# EasyEDA Pro project Complete_project.epro, board PCB1
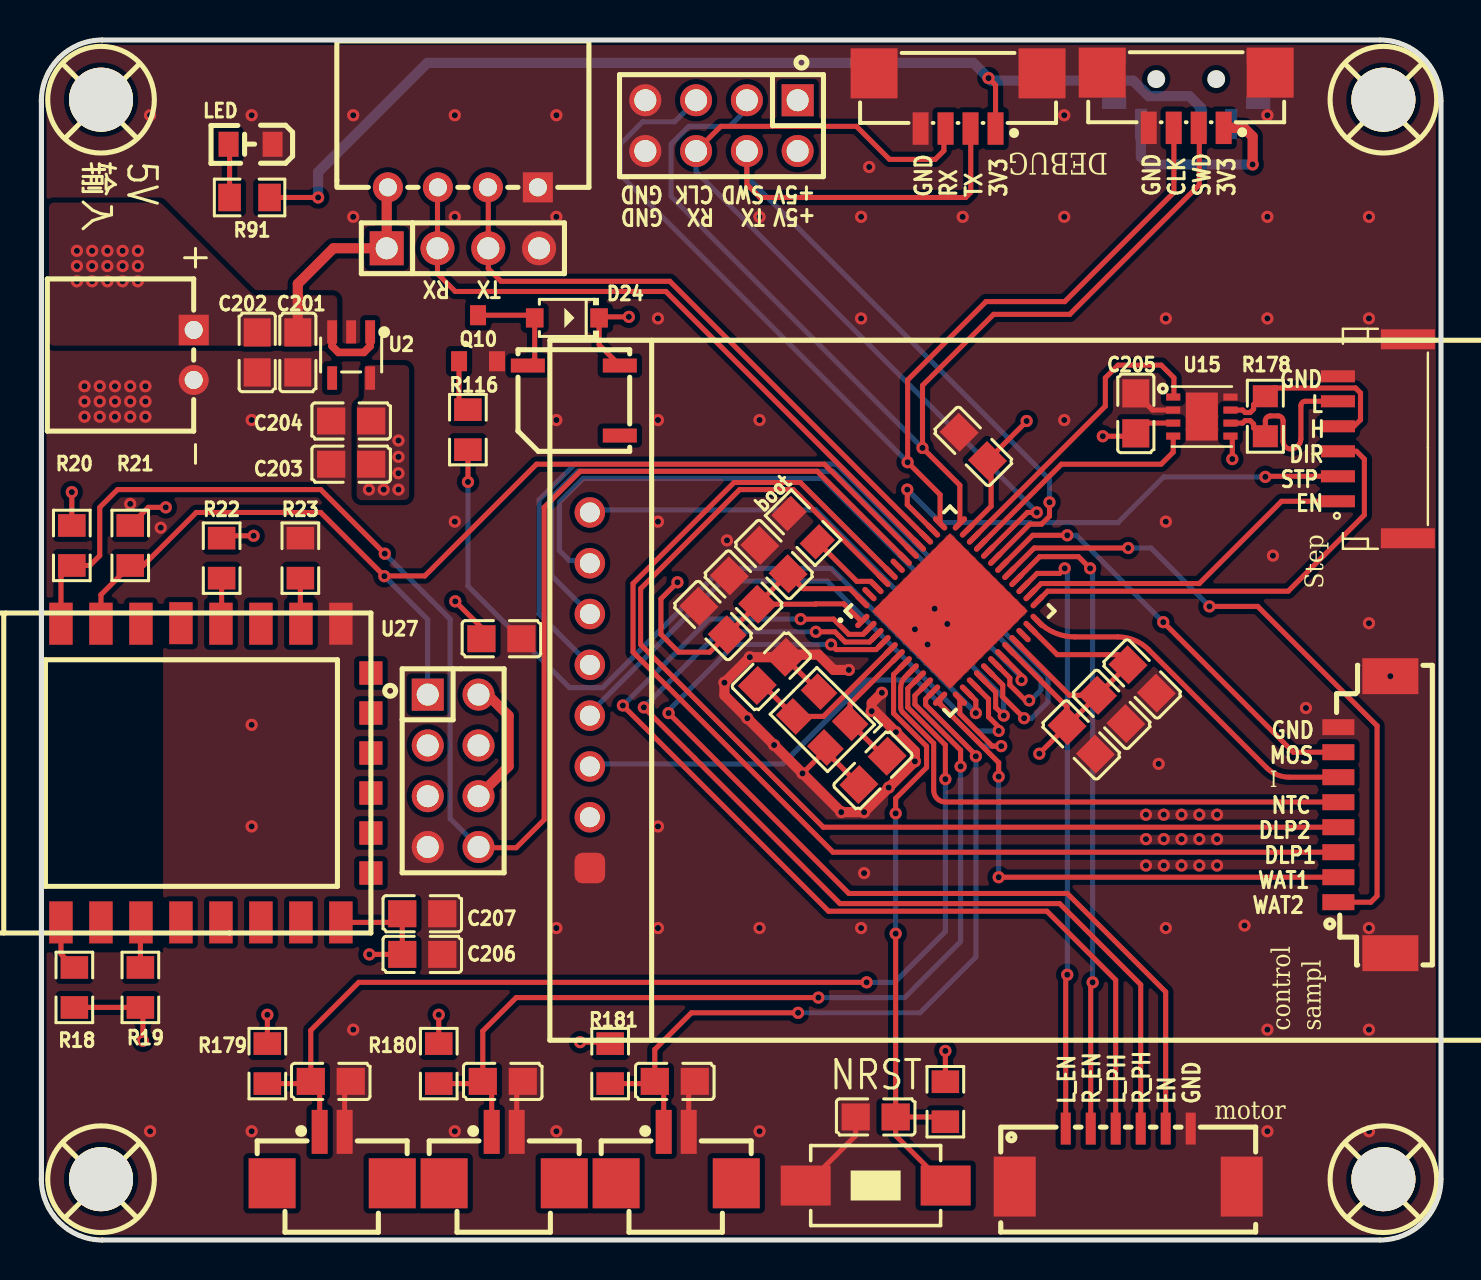
[diagram p12: board, top side]
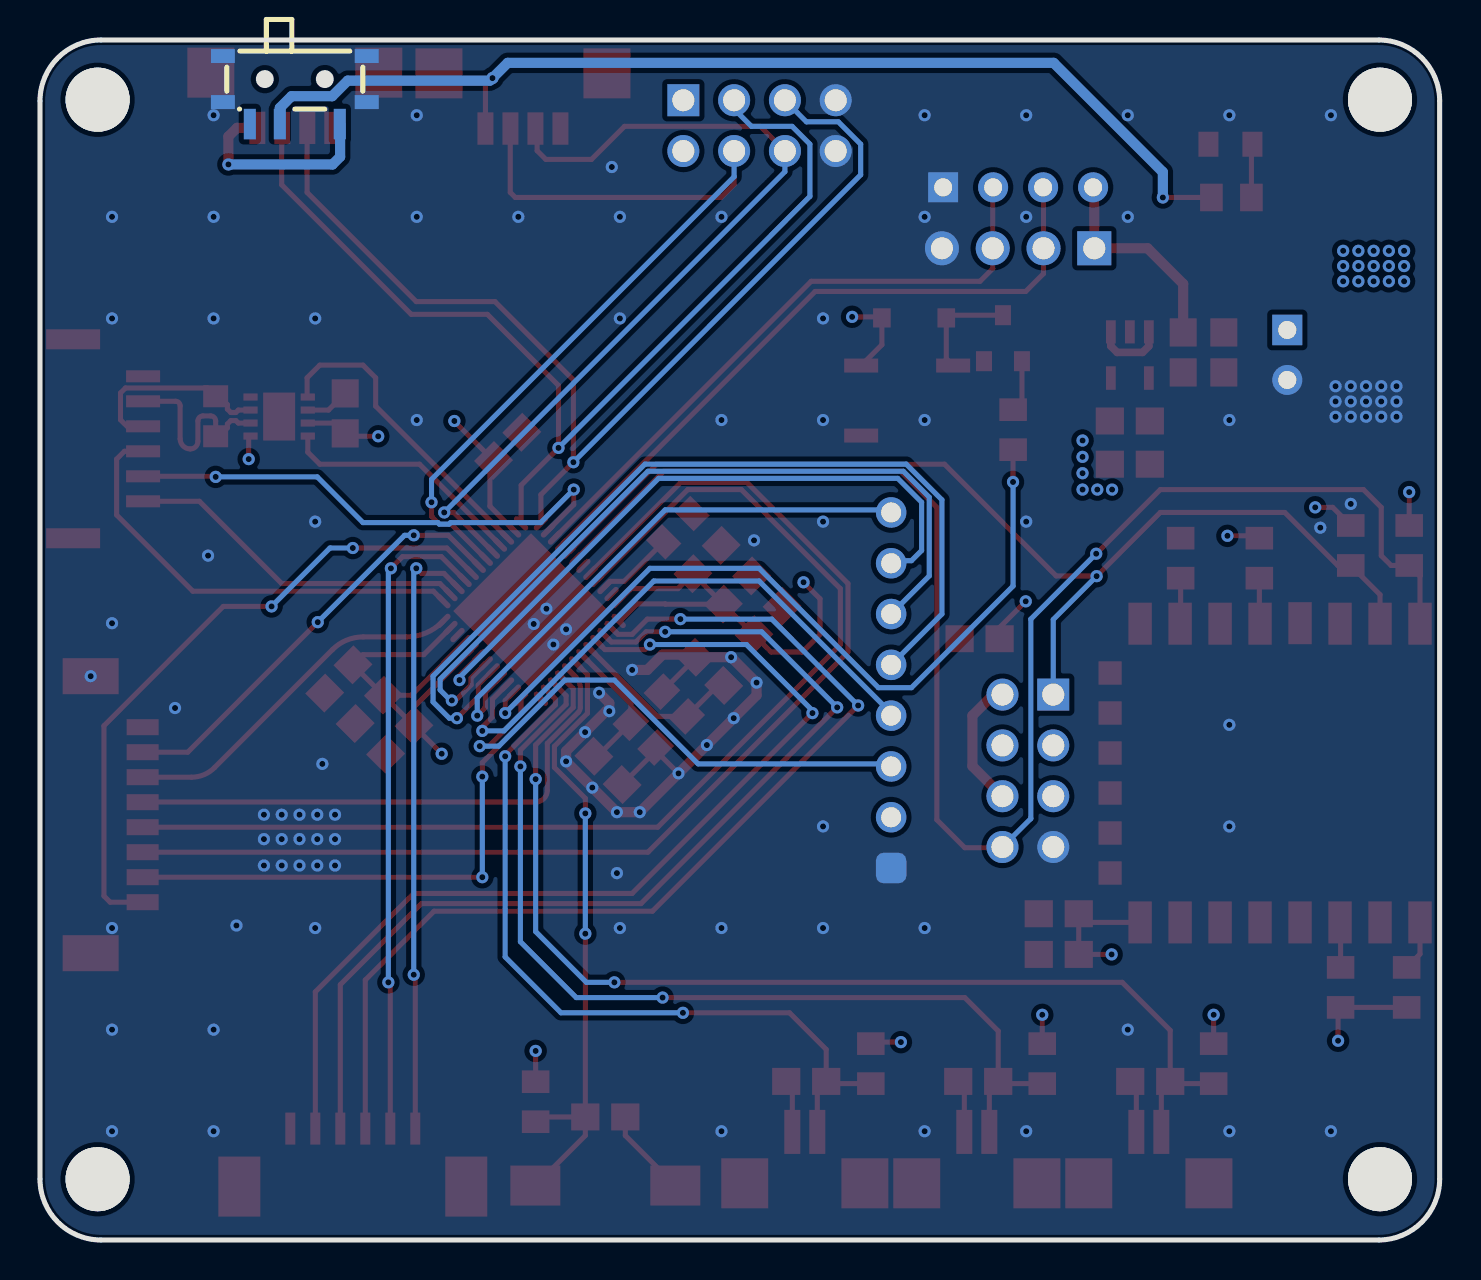
[diagram p13: board, bottom side, seen from below]

Outline 70 x 60 mm; copper layers: Top Layer, POWER, GND, Bottom Layer. Coordinates in mm from the lower left corner of the outline.
Outline path: 0,56.95 0,3.05 arc(0.89,0.89) 3.05,0 66.95,0 arc(69.11,0.89) 70,3.05 70,56.95 arc(69.11,59.11) 66.95,60 3.05,60 arc(0.89,59.11) 0,56.95
Stack: Top Layer 0.035mm 外层铜厚1oz / Dielectric1 0.2104mm 7628 RC49% 8.6mil / POWER 0.035mm / Dielectric2 1.065mm 1.1mm H/HOZ Copper / GND 0.035mm / Dielectric3 0.2104mm 7628 RC49% 8.6mil / Bottom Layer 0.035mm 外层铜厚1oz

## Design rules (mm)
net CAN_L: CAN
net CAN_H: CAN
template: 自定义配置
spacing copperThickness1oz (default): track to track 0.102, other pairs 0.152 to 0.3
spacing copperThickness2oz: track to track 0.203, other pairs 0.152 to 0.3
track width copperThickness1oz (default): min 0.127, default 0.254, max 2.54
track width copperThickness2oz: min 0.203, default 0.254, max 2.54
differential pair differentialPair (default): width min 0.127, default 0.254, max 2.54; gap min 0.152, default 0.152
via viaSize (default): diameter min 0.5, default 0.61, max 10; hole min 0.3, default 0.305, max 6.3

## Placement (name value [footprint] x y rotation side)
boot  -  [R0805]  38.1 35.62 315 top
BUZZER2  4kHz  [BUZ-SMD_L5.0-W5.5-P4.60]  26.63 41.97 180 top
C10  100nF  [C0805]  41.73 6.15 180 top
C22  100nF  [C0805]  35.12 32.5 315 top
C23  100nF  [C0805]  33.59 30.97 315 top
C36  100nF  [C0805]  36.64 34.02 315 top
C37  100nF  [C0805]  46.61 39.68 315 top
C38  100nF  [C0805]  53.53 26.53 135 top
C39  100nF  [C0805]  55.05 28.05 135 top
C88  100nF  [C0805]  52.01 25 135 top
C89  100nF  [C0805]  23.01 30.06 180 top
C90  100nF  [C0805]  14.47 7.93 0 top
C142  22pF  [C0805]  36.51 28.43 225 top
C143  22pF  [C0805]  41.59 23.48 45 top
C145  100nF  [C0805]  23.08 7.93 0 top
C146  100nF  [C0805]  31.68 7.93 0 top
C201  100nF  [C0805]  12.83 44.38 90 top
C202  100nF  [C0805]  10.79 44.38 90 top
C203  100nF  [C0805]  15.49 38.79 0 top
C204  100nF  [C0805]  15.49 40.95 0 top
C205  100nF  [C0805]  54.74 41.33 270 top
C206  100nF  [C0805]  19.05 14.28 180 top
C207  1uF  [C0805]  19.05 16.31 180 top
CN12  HC-1.25-4PLT  [CONN-SMD_4P-P1.25_HCTL_HC-1.25-4PLT]  57.26 56.99 180 top
CN16  ZX-XH2.54-2PWZ  [CONN-TH_2P-P2.50_ZX-XH2.54-2PWZ]  7.62 44.25 270 top
CN17  HC-1.25-4PLT  [CONN-SMD_4P-P1.25_HCTL_HC-1.25-4PLT]  45.85 56.95 180 top
CN18  HC-1.25-2PWT  [CONN-SMD_2P-P1.25-HC-1.25-2PWT]  14.54 4.12 0 top
CN19  HC-1.25-2PWT  [CONN-SMD_2P-P1.25-HC-1.25-2PWT]  23.15 4.12 0 top
CN20  HC-1.25-2PWT  [CONN-SMD_2P-P1.25-HC-1.25-2PWT]  31.75 4.12 0 top
control
sampl  -  [CONN-SMD_8P-P1.25-L4.4-W14.8]  66.17 21.27 90 top
D24  1N4148W  [SOD-123_L2.7-W1.6-LS3.7-FD]  26.28 46.11 0 top
H4  -  [HDR-TH_8P-P2.54-V-F-R2-C4-S2.54-1]  34.02 55.72 180 top
H9  -  [HDR-TH_8P-P2.54-V-F-R2-C4-S2.54-1]  20.59 23.46 270 top
H12  -  [HDR-TH_4P-P2.54-V-M]  21.08 49.59 0 top
LED  -  [LED_0805]  10.41 54.79 180 top
motor  -  [CONN-SMD_1.25-6PWT]  54.36 4.12 180 top
Q10  -  [S8050_SOT-23]  21.71 45.09 270 top
R6  10K  [R0805]  45.21 6.91 90 top
R18  1K  [R0805]  1.65 12.63 90 top
R19  1K  [R0805]  4.95 12.63 90 top
R20  5.1K  [R0805]  1.52 34.73 90 top
R21  5.1K  [R0805]  4.44 34.73 90 top
R22  1K  [R0805]  9.02 34.09 90 top
R23  1K  [R0805]  12.95 34.09 90 top
R91  10K  [R0805]  10.41 52.13 0 top
R116  2K  [R0805]  21.33 40.52 90 top
R178  120Ω  [R0805_S]  61.21 42.19 270 top
R179  10K  [R0805]  11.3 8.82 90 top
R180  10K  [R0805]  19.88 8.82 90 top
R181  10K  [R0805]  28.45 8.82 90 top
RESET1  -  [SW_PB2_A1]  41.78 2.72 90 top
SCREW1  -  [M3螺丝]  3.05 2.98 0 top
SCREW2  -  [M3螺丝]  3.05 56.95 0 top
SCREW3  -  [M3螺丝]  67.18 56.95 0 top
SCREW4  -  [M3螺丝]  67.18 2.98 0 top
Step  -  [CONN-TH_SM06B-GHS-TB-LF-SN]  66.59 40.06 90 top
SW5  MSK12C02  [SW-TH_MSK12C02]  57.26 57.5 0 bottom
U2  RT9013-33GB  [SOT-23-5_L3.0-W1.7-P0.95-LS2.8-BL]  15.49 44.25 180 top
U15  TJA1051TK/3/1J  [HVSON-8_L3.0-W3.0-P0.65-BL-EP]  58.04 41.17 270 top
U26  STM32G431CBU6  [UFQFPN-48_L7.0-W7.0-P0.50-BL-EP]  45.44 31.45 315 top
U27  -  [ESP12F]  6.98 23.3 90 top
U28  -  [1.8__TFT LCD]  27.43 18.6 90 top
U51  ZX-XH2.54-4PWZ-Y  [CONN-TH_4P-P2.50_ZX-XH2.54-4PWZ-Y]  21.08 52.63 180 top
X1  25MHz  [OSC-SMD_4P-L3.2-W2.5-BL]  39.05 26.02 135 top

## Footprints (pads in the part's own frame, mm; a bottom-side part is the same pattern mirrored in y, then rotated)
1.8__TFT LCD
  custom 0x0 hole 1: 1(0,0)
  round 1.524 hole 1: 2(2.54,0) 3(5.08,0) 4(7.62,0) 5(10.16,0) 6(12.7,0) 7(15.24,0) 8(17.78,0)
BUZ-SMD_L5.0-W5.5-P4.60
  rect 1.7x0.7 smd: 1(-2.3,-1.75) 2(2.3,-1.75) 3(-2.3,1.75)
C0805
  rect 1.41x1.35 smd: 1(-1,0) 2(1,0)
CONN-SMD_1.25-6PWT
  rect 0.5x1.6 smd: 1(3.125,-1.45) 2(1.875,-1.45) 3(0.625,-1.45) 4(-0.625,-1.45) 5(-1.875,-1.45) 6(-3.125,-1.45)
  rect 2.1x3 smd: 7(-5.675,1.45) 8(5.675,1.45)
CONN-SMD_2P-P1.25-HC-1.25-2PWT
  rect 0.8x2.2 smd: 1(-0.625,1.285) 2(0.625,1.285)
  rect 2.35x2.5 smd: 3(-3.005,-1.285) 4(3.005,-1.285)
CONN-SMD_4P-P1.25_HCTL_HC-1.25-4PLT
  rect 0.8x1.62 smd: 1(-1.875,1.38) 2(-0.625,1.38) 3(0.625,1.38) 4(1.875,1.38)
  rect 2.35x2.5 smd: 5(-4.2,-1.38) 6(4.2,-1.38)
CONN-SMD_8P-P1.25-L4.4-W14.8
  rect 1.8x2.8 smd: 0(-6.925,-1.3) 0(6.925,-1.3)
  rect 0.8x1.6 smd: 1(-4.375,1.3) 2(-3.125,1.3) 3(-1.875,1.3) 4(-0.625,1.3) 5(0.625,1.3) 6(1.875,1.3) 7(3.125,1.3) 8(4.375,1.3)
CONN-TH_2P-P2.50_ZX-XH2.54-2PWZ
  rect 1.524x1.5 hole 0.9: 1(-1.25,0)
  round 1.5 hole 0.9: 2(1.25,0)
CONN-TH_4P-P2.50_ZX-XH2.54-4PWZ-Y
  rect 1.5x1.5 hole 0.9: 1(-3.75,0)
  round 1.5 hole 0.9: 2(-1.25,0) 3(1.25,0) 4(3.75,0)
CONN-TH_SM06B-GHS-TB-LF-SN
  rect 0.6x1.7 smd: 1(-3.126,1.75) 2(-1.875,1.75) 3(-0.625,1.75) 4(0.625,1.75) 5(1.875,1.75) 6(3.124,1.75)
  rect 1x2.7 smd: 7(-4.974,-1.749) 8(4.974,-1.75)
ESP12F
  rect 2.1x1.17 smd: 1(-7.417,6.003) 2(-7.417,4.003) 3(-7.417,2.003) 4(-7.417,0.004) 5(-7.417,-1.996) 6(-7.417,-3.997) 7(-7.417,-5.997) 8(-7.417,-7.997) 15(7.519,-7.997) 16(7.519,-5.997) 17(7.519,-3.997) 18(7.519,-1.996) 19(7.544,0.004) 20(7.519,2.003) 21(7.519,4.003) 22(7.519,6.003)
  custom 0x0 smd: 9(-4.948,-9.496) 10(-2.948,-9.496) 11(-0.948,-9.496) 12(1.052,-9.496) 13(3.052,-9.496) 14(5.052,-9.496)
HDR-TH_4P-P2.54-V-M
  rect 1.7x1.7 hole 1.1: 1(-3.81,0)
  round 1.7 hole 1.1: 2(-1.27,0) 3(1.27,0) 4(3.81,0)
HDR-TH_8P-P2.54-V-F-R2-C4-S2.54-1
  rect 1.6x1.6 hole 1.1: 1(-3.81,-1.27)
  round 1.6 hole 1.1: 2(-3.81,1.27) 3(-1.27,-1.27) 4(-1.27,1.27) 5(1.27,-1.27) 6(1.27,1.27) 7(3.81,-1.27) 8(3.81,1.27)
HVSON-8_L3.0-W3.0-P0.65-BL-EP
  rect 0.355x0.711 smd: 1(-0.976,-1.433) 2(-0.325,-1.433) 3(0.325,-1.433) 4(0.976,-1.433) 5(0.976,1.433) 6(0.325,1.433) 7(-0.325,1.433) 8(-0.976,1.433)
  rect 2.401x1.6 smd: 9(0,0)
LED_0805
  rect 1x1.25 smd: 1(-1.15,0.005) 2(1.05,0.005)
M3螺丝
  round 3.2 hole 3.2: 1(-0.064,0.064)
OSC-SMD_4P-L3.2-W2.5-BL
  rect 1.4x1.2 smd: 1(-1.1,-0.875) 2(1.1,-0.875) 3(1.1,0.875) 4(-1.1,0.875)
R0805
  rect 1.133x1.377 smd: 1(-1,0) 2(1,0)
R0805_S
  rect 1.1x1.25 smd: 1(0,0) 2(2,0)
S8050_SOT-23
  rect 1x0.8 smd: 1(1.15,-0.823) 2(1.15,1.077) 3(-1.15,0.127)
SOD-123_L2.7-W1.6-LS3.7-FD
  rect 0.88x0.96 smd: 1(-1.61,0) 2(1.61,0)
SOT-23-5_L3.0-W1.7-P0.95-LS2.8-BL
  rect 0.49x1.157 smd: 1(-0.95,-1.153) 2(0,-1.153) 3(0.95,-1.153)
  rect 0.49x1.175 smd: 4(0.95,1.153) 5(-0.95,1.153)
SW-TH_MSK12C02
  rect 0.6x1.524 smd: 1(-2.25,1.7) 2(0.75,1.7) 3(2.25,1.7)
  rect 1.2x0.7 smd: 4(-3.6,-1.7) 4(-3.6,0.6) 4(3.6,-1.7) 4(3.6,0.6)
SW_PB2_A1
  rect 2x2.5 smd: 1(0,3.556) 2(0,-3.444)
UFQFPN-48_L7.0-W7.0-P0.50-BL-EP
  oval 0.28x0.9 smd: 1(-2.751,-3.45) 2(-2.251,-3.45) 3(-1.75,-3.45) 4(-1.25,-3.45) 5(-0.749,-3.45) 6(-0.249,-3.45) 7(0.249,-3.45) 8(0.75,-3.45) 9(1.25,-3.45) 10(1.75,-3.45) 11(2.251,-3.45) 12(2.751,-3.45) 25(2.751,3.449) 26(2.251,3.449) 27(1.75,3.449) 28(1.25,3.449) 29(0.75,3.449) 30(0.249,3.449) 31(-0.249,3.449) 32(-0.749,3.449) 33(-1.25,3.449) 34(-1.75,3.449) 35(-2.251,3.449) 36(-2.751,3.449)
  oval 0.9x0.28 smd: 13(3.45,-2.751) 14(3.45,-2.251) 15(3.45,-1.75) 16(3.45,-1.25) 17(3.45,-0.75) 18(3.45,-0.249) 19(3.45,0.249) 20(3.45,0.749) 21(3.45,1.25) 22(3.45,1.75) 23(3.45,2.251) 24(3.45,2.751) 37(-3.449,2.751) 38(-3.449,2.251) 39(-3.449,1.75) 40(-3.449,1.25) 41(-3.449,0.749) 42(-3.449,0.249) 43(-3.449,-0.249) 44(-3.449,-0.75) 45(-3.449,-1.25) 46(-3.449,-1.75) 47(-3.449,-2.251) 48(-3.449,-2.751)
  rect 5.5x5.5 smd: 49(0,0)

## Nets
+3.3V: BUZZER2.1 C22.2 C23.2 C36.2 C37.2 C38.2 C39.2 C88.2 C89.2 C203.2 C204.2 C206.2 C207.2 CN17.1 D24.2 H9.2 H9.6 R6.2 R18.1 R19.1 R20.2 R21.2 R22.2 R91.2 R179.2 R180.2 R181.2 SW5.2 U2.5 U15.5 U26.1 U26.20 U26.21 U26.23 U26.35 U26.48 U27.8 U28.2
+5V: C201.2 C202.2 C205.2 CN16.1 H4.1 H4.2 H12.1 U2.1 U2.3 U15.3 U51.4
GND: boot.1 C10.2 C22.1 C23.1 C36.1 C37.1 C38.1 C39.1 C88.1 C89.1 C90.2 C142.1 C143.1 C145.2 C146.2 C201.1 C202.1 C203.1 C204.1 C205.1 C206.1 C207.1 CN12.4 CN12.5 CN12.6 CN16.2 CN17.4 CN17.5 CN17.6 CN18.2 CN19.2 CN20.2 control
sampl.0 control
sampl.8 H4.7 H4.8 H9.7 H12.4 LED.1 motor.6 motor.7 motor.8 Q10.2 R23.2 RESET1.1 Step.6 Step.7 Step.8 SW5.4 U2.2 U15.2 U15.8 U15.9 U26.49 U27.15 U28.1 U51.1 X1.2 X1.4
ADC_I: control
sampl.6 U26.24
ADC_NTC: control
sampl.5 U26.8
BEEP: R116.1 U26.14
BOOT0: boot.2 U26.46
CAN_H: R178.1 Step.4 U15.7
CAN_L: R178.2 Step.5 U15.6
DEBUG_RX: CN17.3 H4.6 U26.32
DEBUG_TX: CN17.2 H4.4 U26.31
DLP1: control
sampl.3 U26.44
DLP2: control
sampl.4 U26.45
ESP_RX: H9.8 R20.1 U26.42 U27.22
ESP_TX: H9.1 R21.1 U26.41 U27.21
FDCAN_RX: U15.4 U26.33
FDCAN_TX: U15.1 U26.34
KEY1: C90.1 CN18.1 R179.1 U26.9
KEY2: C145.1 CN19.1 R180.1 U26.10
KEY3: C146.1 CN20.1 R181.1 U26.11
L_EN_IN: motor.1 U26.27
L_PH_IN: motor.3 U26.2
LCD_BLK: U26.16 U28.8
LCD_CS: U26.19 U28.7
LCD_DC: U26.18 U28.6
LCD_RST: U26.17 U28.5
LCD_RX: H12.2 U26.40 U51.3
LCD_SCK: U26.13 U28.3
LCD_SDA: U26.15 U28.4
LCD_TX: H12.3 U26.39 U51.2
M_DIR: Step.3 U26.25
M_EN: Step.1 U26.26
M_STP: Step.2 U26.38
MCU_MOS: control
sampl.7 U26.30
MOTOR_EN: motor.5 U26.4
NRST: C10.1 R6.1 RESET1.2 U26.7
OSC_IN: C142.2 U26.5 X1.3
OSC_OUT: C143.2 U26.6 X1.1
R_EN_IN: motor.2 U26.28
R_PH_IN: motor.4 U26.3
SWCLK: CN12.3 H4.5 U26.37
SWDIO: CN12.2 H4.3 U26.36
TIM3_CH1: control
sampl.1 U26.29
TIM3_CH2: control
sampl.2 U26.12
$1N5298: BUZZER2.2 D24.1 Q10.3
$1N5299: Q10.1 R116.2
$1N5859: CN12.1 SW5.1
$1N19115: LED.2 R91.1
$1N23213: R19.2 U27.3
$1N23214: R18.2 U27.1
$1N23215: R22.1 U27.18
$1N23223: R23.1 U27.16

Pads without a net: BUZZER2 3; CN18 3 4; CN19 3 4; CN20 3 4; H9 3 4 5; SCREW1 1; SCREW2 1; SCREW3 1; SCREW4 1; SW5 3; U2 4; U26 22 43 47; U27 2 4 5 6 7 9 10 11 12 13 14 17 19 20

## Via types
v1: diameter 0.61, hole 0.305, Top Layer to Bottom Layer, 186 vias

## Routing (per net, layer and track width the routed paths; a pad name or vN(x,y) marks a point on that pad's centre or on a via; arc(x,y) is an arc through that point)
+3.3V: length 364.2
  Top Layer w0.254: U26.35 47.5,36.69 47.5,38.79 ; U27.8 17.62,15.88 C207.2 C206.2 ; C22.2 C23.2 33.42,29.39 31.88,29.39 30.99,30.28 30.99,32.06 v1(31.81,32.89) ; C22.2 38.72,31.79 38.73,31.81 40.13,31.81 40.98,30.95 U26.1 ; C22.2 C36.2 38.09,32.57 40.43,32.57 41.06,31.94 ; v1(6.22,36.63) 5.35,36.63 R21.2 ; 19.88,9.72 v1(19.88,11.26) ; v1(47.37,58.09) 47.72,57.74 CN17.1 ; C88.2 51.3,26.65 U26.20 ; C88.2 49.91,24.32 v1(49.91,24.31) ; C88.2 C38.2 ; C89.2 22.01,30.63 v1(20.7,31.93) ; v1(49.28,40.95) 49.28,40.93 C37.2 ; 9.07,35.21 v1(10.61,35.21) ; D24.2 27.89,44.76 BUZZER2.1 ; R18.1 R19.1 5.08,11.5 v1(5.08,9.96) ; U15.5 59.56,40.11 v1(59.56,39.05) ; U26.21 51.42,27.24 C38.2 ; C38.2 C39.2 54.35,28.77 53.85,29.27 50.81,29.27 U26.23 ; R91.2 v1(13.84,52.13) ; 17.95,14.28 v1(16.41,14.28) ; 27.84,46.16 v1(29.38,46.16) ; 11.3,9.72 v1(11.3,11.26) ; R20.2 v1(1.52,37.39) ; 28.49,9.89 v1(26.95,9.89) ; R6.2 v1(45.21,9.45)
  Top Layer w0.508: H9.2 22.32,27.27 23.37,26.22 23.37,23.69 H9.6
  POWER w0.508: 45.24,10.12 45.21,10.1 v1(45.21,9.45) ; 45.24,10.12 47.15,10.12 49.91,12.88 v1(49.91,24.31) 52.32,26.73 52.32,29.52 47.75,34.09 47.75,39.43 v1(49.28,40.95) 52.07,38.16 58.67,38.16 v1(59.56,39.05) ; 45.24,10.12 27.17,10.12 v1(26.95,9.89) 25.58,11.26 v1(19.88,11.26) v1(11.3,11.26) ; v1(6.22,36.63) 6.22,37.45 6.15,37.52 ; 10.61,37.52 10.61,37.51 v1(10.61,35.21) 11.3,34.52 v1(11.3,11.26) ; 10.61,37.52 6.15,37.52 ; 10.61,37.52 v1(16.38,37.52) 16.41,37.5 v1(16.41,14.28) ; v1(17.86,37.52) 20.7,34.68 v1(20.7,31.93) 21.86,30.77 H9.2 ; 6.15,37.52 1.65,37.52 v1(1.52,37.39) ; v1(31.81,32.89) 31.81,43.73 v1(29.38,46.16) 19.3,46.16 17.86,44.71 v1(17.86,39.97) ; H9.6 26.38,22.19 U28.2 ; v1(13.84,52.13) 13.84,49.08 17.12,45.8 v1(17.12,37.52) ; v1(11.3,11.26) 6.38,11.26 v1(5.08,9.96)
  Bottom Layer w0.508: 58.01,55.8 58.01,56.6 57.42,57.19 55.39,57.19 54.61,57.97 47.5,57.97 46.61,58.86 19.3,58.86 13.84,53.4 v1(13.84,52.13)
  vias: v1(17.86,39.16) v1(17.86,38.34)
+5V: length 67.3
  Top Layer w0.254: U15.3 55.25,40.85 C205.2 54.59,40.19 v1(53.09,40.19)
  Top Layer w0.381: U2.1 16.44,44.69 16.13,44.38 14.86,44.38 14.54,44.69 U2.3
  Top Layer w0.508: U51.4 17.27,52.57 H12.1 14.61,49.59 12.83,47.81 C201.2
  POWER w0.254: H4.2 38.83,54.45 v1(53.09,40.19)
  POWER w0.508: H4.2 H4.1 37.85,57.01 37.85,57.97 36.96,58.86 21.72,58.86 17.33,54.47 U51.4
  vias: v1(1.78,49.46) v1(1.78,48.7) v1(1.78,47.94) v1(2.54,49.46) v1(2.54,48.7) v1(2.54,47.94) v1(3.3,49.46) v1(3.3,48.7) v1(3.3,47.94) v1(4.06,49.46) v1(4.06,48.7) v1(4.06,47.94) v1(4.83,49.46) v1(4.83,48.7) v1(4.83,47.94)
GND: length 46.7
  Top Layer w0.254: C10.2 40.73,5.22 RESET1.1 ; CN18.2 15.17,7.62 arc(15.26,7.84) C90.2 ; CN19.2 23.77,7.62 arc(23.86,7.84) C145.2 ; 39.21,24.47 v1(38.07,23.33) ; 39.21,24.47 X1.4 ; 39.21,24.47 39.21,24.45 C143.1 ; X1.2 37.22,29.09 C142.1 ; C205.1 55.57,41.5 U15.2 ; CN20.2 32.37,7.62 arc(32.46,7.84) C146.2
  Top Layer w0.508: v1(40.39,28.5) 39.62,28.5 38.86,29.27 37.34,29.27 C142.1 v1(35.43,29.14) v1(34.16,27.87) 34.16,27.23 v1(35.3,26.09) v1(36.65,24.75) v1(38.07,23.33) v1(40,21.39) v1(41.15,21.39) v1(42.38,22.62) v1(43.69,23.93) 43.69,24.44 v1(42.74,25.39) 41.69,26.44 v1(41.53,26.44) 41.53,26.85 v1(42.04,27.36)
  vias: v1(2.16,42.69) v1(2.16,41.93) v1(2.16,41.16) v1(2.92,42.69) v1(2.92,41.93) v1(2.92,41.16) v1(3.68,42.69) v1(3.68,41.93) v1(3.68,41.16) v1(4.44,42.69) v1(4.44,41.93) v1(4.44,41.16) v1(4.44,36.8) v1(5.21,42.69) v1(5.21,41.93) v1(5.21,41.16) v1(5.44,56.24) v1(5.44,5.44) v1(5.97,35.62) v1(10.52,56.24) v1(10.52,41) v1(10.52,25.76) v1(10.52,20.68) v1(10.52,5.44) v1(15.6,56.24) v1(15.6,51.16) v1(15.6,10.52) v1(20.68,56.24) v1(20.68,51.16) v1(20.68,35.92) v1(20.68,5.44) v1(25.76,56.24) v1(25.76,51.16) v1(25.76,41) v1(25.76,15.6) v1(25.76,5.44) v1(30.84,46.08) v1(30.84,41) v1(30.84,35.92) v1(30.84,20.68) v1(30.84,15.6) v1(34.29,34.98) v1(35.92,51.16) v1(35.92,41) v1(35.92,15.6) v1(35.92,5.44) v1(41,51.16) v1(41,46.08) v1(41,15.6) v1(41.15,18.34) v1(41.4,53.65) v1(43.69,30.54) v1(44.32,29.77) v1(44.67,31.56) v1(45.31,30.8) v1(46.08,51.16) v1(51.16,56.24) v1(51.16,51.16) v1(51.16,41) v1(55.24,21.27) v1(55.24,20.04) v1(55.24,18.72) v1(55.88,23.81) v1(56.13,21.27) v1(56.13,20.04) v1(56.13,18.72) v1(56.24,46.08) v1(56.24,35.92) v1(56.24,15.6) v1(57.02,21.27) v1(57.02,20.04) v1(57.02,18.72) v1(57.91,21.27) v1(57.91,20.04) v1(57.91,18.72) v1(58.8,21.27) v1(58.8,20.04) v1(58.8,18.72) v1(60.17,15.72) v1(61.32,56.24) v1(61.32,51.16) v1(61.32,46.08) v1(61.32,10.52) v1(61.32,5.44) v1(61.59,34.22) v1(63.25,26.6) v1(66.4,51.16) v1(66.4,46.08) v1(66.4,30.84) v1(66.4,15.6) v1(66.4,10.52) v1(66.4,5.44) v1(67.47,28.19)
ADC_I: length 18
  Top Layer w0.254: control
sampl.6 62.42,23.14 arc(61.8,23.26) 61.28,23.61 55.37,29.52 arc(54.67,29.99) 53.84,30.16 51.68,30.16 arc(50.71,30.35) 49.88,30.9 49.83,30.95
ADC_NTC: length 27.4
  Top Layer w0.254: U26.8 43.19,28.14 arc(43.03,27.9) 42.98,27.61 42.98,26.63 arc(43,26.49) 43.08,26.38 44.63,24.83 44.63,22.48 arc(44.8,22.07) 45.21,21.9 64.86,21.9 arc(64.86,21.9) control
sampl.5
BEEP: length 41.1
  Top Layer w0.254: v1(46.74,26.34) 46.74,26.97 U26.14 ; v1(21.34,37.9) 21.34,39.51 R116.1
  Bottom Layer w0.254: v1(46.74,26.34) 39.5,33.58 34.04,33.58 28.07,27.61 26.42,27.61 21.34,32.69 v1(21.34,37.9)
BOOT0: length 3.9
  Top Layer w0.254: 38.81,34.91 40.78,32.93 41.48,32.93 U26.46
CAN_H: length 10
  Top Layer w0.254: U15.7 60.08,41.5 60.2,41.38 60.46,41.38 60.63,41.55 60.63,41.77 61.05,42.19 R178.1 61.63,42.6 65.72,42.6 65.97,42.35 65.97,41.01 65.53,40.57 64.96,40.57 Step.4
CAN_L: length 10.2
  Top Layer w0.254: Step.5 63.22,41.94 arc(63.06,41.87) 62.99,41.71 62.99,40.06 arc(62.84,39.7) 62.48,39.55 arc(62.21,39.66) 62.1,39.93 62.1,40.95 arc(62.03,41.13) 61.85,41.2 61.47,41.2 arc(61.29,41.13) 61.21,40.95 R178.2 61.05,40.19 60.63,40.61 60.63,40.8 60.46,40.97 60.2,40.97 60.08,40.85 U15.6
DEBUG_RX: length 43.3
  Top Layer w0.254: v1(49.78,36.38) 49.31,36.38 U26.32 ; H4.6 33.98,55.68 40.77,55.68 42.42,54.03 44.7,54.03 45.14,54.46 45.14,55.49 CN17.3
  Bottom Layer w0.254: H4.6 32.74,53.42 v1(49.78,36.38)
DEBUG_TX: length 44.6
  Top Layer w0.254: H4.4 35.28,52.78 35.94,52.13 46.23,52.13 46.48,52.38 46.48,55.56 CN17.2 ; U26.31 49.44,35.79 50.03,35.79 50.42,36.19 v1(50.42,36.89)
  Bottom Layer w0.254: v1(50.42,36.89) 50.42,38.03 35.28,53.16 H4.4
DLP1: length 59.7
  Top Layer w0.254: U26.44 37.95,37.88 34.65,37.88 29.59,32.82 29.59,29.39 39.59,19.39 control
sampl.3
DLP2: length 57.5
  Top Layer w0.254: control
sampl.4 39.11,20.64 29.97,29.77 29.97,32.57 34.92,37.52 37.6,37.52 U26.45
ESP_RX: length 79.8
  Top Layer w0.254: U26.42 38.81,38.44 26.95,38.44 25.15,36.63 25.15,21.01 23.75,19.61 21.9,19.61 H9.8 ; v1(17.18,34.31) 13.97,37.52 3.81,37.52 2.92,36.63 2.92,34.22 2.43,33.73 R20.1 0.98,33.18 U27.22
  Bottom Layer w0.254: H9.8 20.45,21.07 20.45,31.04 v1(17.18,34.31)
ESP_TX: length 56
  Top Layer w0.254: U26.41 39.16,38.79 24.77,38.79 19.18,33.2 17.17,33.2 v1(17.16,33.19) 13.97,36.38 7.75,36.38 5.1,33.73 R21.1 2.98,32.26 U27.21
  Bottom Layer w0.254: 19.33,27.27 19.33,31.02 v1(17.16,33.19)
FDCAN_RX: length 12.3
  Top Layer w0.254: U15.4 56.61,39.39 56.01,38.79 51.02,38.79 U26.33
FDCAN_TX: length 15.6
  Top Layer w0.254: U26.34 53.21,41.69 53.21,43.11 53.85,43.74 56.01,43.74 56.64,43.11 56.64,42.18 U15.1
KEY1: length 55.1
  Top Layer w0.254: v1(41.27,12.88) 15.87,12.88 13.47,10.48 C90.1 ; CN18.1 13.92,7.49 arc(13.79,7.8) C90.1 ; C90.1 arc(13.44,7.85) 13.36,7.82 R179.1 ; v1(45.21,23.04) 45.21,24.75 43.33,26.63 43.33,27.57 U26.9
  Bottom Layer w0.254: v1(41.27,12.88) 42.67,12.88 45.21,15.42 v1(45.21,23.04)
KEY2: length 47.3
  Top Layer w0.254: v1(38.86,12.12) 23.75,12.12 22.08,10.45 C145.1 ; C145.1 arc(22.04,7.85) 21.97,7.82 R180.1 ; C145.1 arc(22.39,7.8) 22.52,7.49 CN19.1 ; U26.10 43.69,27.22 43.69,26.78 45.97,24.49 v1(45.97,23.68)
  Bottom Layer w0.254: v1(45.97,23.68) 45.97,14.92 43.18,12.12 v1(38.86,12.12)
KEY3: length 39.1
  Top Layer w0.254: R181.1 30.57,7.82 arc(30.65,7.85) C146.1 ; C146.1 30.68,9.53 32.51,11.36 v1(37.85,11.36) ; C146.1 arc(30.99,7.8) 31.12,7.49 CN20.1 ; 44.59,27.42 44.23,27.05 44.23,26.76 46.74,24.25 v1(46.74,24.19)
  Bottom Layer w0.254: v1(46.74,24.19) 46.74,14.15 43.94,11.36 v1(37.85,11.36)
L_EN_IN: length 30.5
  Top Layer w0.254: v1(51.18,33.58) 50.93,33.33 49.8,33.33 U26.27 ; v1(51.31,13.26) 51.23,13.19 motor.1
  Bottom Layer w0.254: v1(51.18,33.58) 51.31,33.46 v1(51.31,13.26)
L_PH_IN: length 52.3
  Top Layer w0.254: v1(29.08,26.73) 39.37,16.44 50.29,16.44 53.73,13 motor.3 ; v1(37.97,31.04) 39.62,31.04 40.39,30.28 41.09,30.28 U26.2
  Bottom Layer w0.254: v1(29.08,26.73) 33.4,31.04 v1(37.97,31.04)
LCD_BLK: length 28.2
  Top Layer w0.254: U26.16 47.73,27.4 47.73,26.62 v1(48.13,26.22)
  Bottom Layer w0.254: 27.05,36.5 38.73,36.5 48.13,27.11 v1(48.13,26.22)
LCD_CS: length 33.2
  Top Layer w0.254: U26.19 49.02,28.22 v1(49.02,28)
  Bottom Layer w0.254: v1(49.02,28) 49.02,28.12 39.06,38.08 27.1,38.08 25.91,36.89 25.91,34.47 26.42,33.97 27.05,33.97
LCD_DC: length 39.7
  Top Layer w0.254: v1(49.4,26.98) 49.21,26.98 48.44,27.75 48.44,28.1 U26.18
  Bottom Layer w0.254: v1(49.4,26.98) 49.47,26.98 49.99,27.5 49.99,28.05 39.6,38.44 26.82,38.44 25.53,37.14 25.53,33.2 27.05,31.68 27.05,31.42
LCD_RST: length 45.8
  Top Layer w0.254: U26.17 48.08,27.75 48.08,27.16 v1(49.15,26.09)
  Bottom Layer w0.254: U28.5 24.89,31.3 24.89,37.01 26.68,38.79 39.74,38.79 50.34,28.19 50.34,26.9 49.53,26.09 v1(49.15,26.09)
LCD_RX: length 34
  Top Layer w0.254: U26.40 31.23,47.43 20.7,47.43 19.81,48.32 H12.2 19.81,52.61 U51.3
LCD_SCK: length 27.5
  Top Layer w0.254: U26.13 45.94,26.31 47.56,24.69 v1(48.01,24.69)
  Bottom Layer w0.254: 27.05,23.81 37.08,23.81 41.27,28 43.75,28 47.05,24.69 v1(48.01,24.69)
LCD_SDA: length 29.5
  Top Layer w0.254: v1(47.88,25.46) 47.88,25.65 47.37,26.16 47.37,27.05 U26.15
  Bottom Layer w0.254: 27.05,26.34 27.43,26.34 34.04,32.95 39.3,32.95 46.8,25.46 v1(47.88,25.46)
LCD_TX: length 31.5
  Top Layer w0.254: U51.2 22.35,52.61 H12.3 22.35,48.57 22.99,47.94 31.43,47.94 U26.39
M_DIR: length 22.4
  Top Layer w0.254: 49.83,31.94 50.33,32.44 62.36,32.44 66.17,36.25 66.17,39.05 65.78,39.44 Step.3
M_EN: length 17.3
  Top Layer w0.254: 49.47,32.3 50,32.82 57.91,32.82 62.03,36.94 Step.1
M_STP: length 25.8
  Top Layer w0.254: v1(61.21,38.16) 61.24,38.19 Step.2 ; 44.59,35.48 43.31,36.77 v1(43.31,37.52)
  Bottom Layer w0.254: v1(43.31,37.52) 44.96,35.87 49.47,35.87 49.54,35.79 50.03,35.79 50.1,35.87 53.85,35.87 56.13,38.16 v1(61.21,38.16)
MCU_MOS: length 21.9
  Top Layer w0.254: v1(51.31,35.23) 49.58,35.23 U26.30 ; control
sampl.7 62.61,24.39 v1(56.11,30.89)
  Bottom Layer w0.254: v1(51.31,35.23) 51.77,35.23 v1(56.11,30.89)
MOTOR_EN: length 50
  Top Layer w0.254: v1(31.37,26.34) 40.39,17.33 51.31,17.33 56.23,12.41 motor.5 ; v1(39.5,29.77) 39.75,29.52 41.75,29.52 U26.4
  Bottom Layer w0.254: v1(39.5,29.77) 34.67,29.77 31.37,26.47 v1(31.37,26.34)
NRST: length 31.3
  Top Layer w0.254: R6.1 44.97,6.15 C10.1 ; RESET1.2 42.73,5.22 C10.1 ; C10.1 v1(42.73,15.32) ; U26.7 42.62,28.27 42.62,26.34 44.27,24.69 44.27,23.63 42.73,22.08 v1(42.73,21.33)
  Bottom Layer w0.254: v1(42.73,15.32) v1(42.73,21.33)
OSC_IN: length 8.7
  Top Layer w0.254: C142.2 36.11,27.73 X1.3 39.11,26.18 U26.5
OSC_OUT: length 6.9
  Top Layer w0.254: C143.2 42.12,24.19 X1.1 40.45,26.81 U26.6
R_EN_IN: length 32.5
  Top Layer w0.254: v1(52.45,33.58) 51.87,34.17 49.93,34.17 U26.28 ; motor.2 52.48,12.79 v1(52.58,12.88)
  Bottom Layer w0.254: v1(52.45,33.58) 52.58,33.46 v1(52.58,12.88)
R_PH_IN: length 51.3
  Top Layer w0.254: 32.65,24.11 39.94,16.82 50.93,16.82 54.98,12.77 motor.4 ; 32.65,24.11 32.31,24.45 v1(30.13,26.63) ; v1(38.73,30.41) 39.69,30.41 40.2,29.9 41.42,29.9 U26.3
  Bottom Layer w0.254: v1(30.13,26.63) 33.91,30.41 v1(38.73,30.41)
SWCLK: length 54.8
  Top Layer w0.254: U26.37 44.95,37.26 v1(43.32,38.89) 43.32,43 47.24,46.92 51.18,46.92 56.64,52.38 56.64,55.6 CN12.3
  Bottom Layer w0.254: H4.5 31.67,55.91 30.07,55.91 28.96,54.79 28.96,53.26 v1(43.32,38.89)
SWDIO: length 53.9
  Top Layer w0.254: U26.36 45.94,37.74 v1(44.07,39.61) 44.07,42.73 47.62,46.28 51.43,46.28 57.91,52.76 57.91,55.58 CN12.2
  Bottom Layer w0.254: H4.3 35.28,56.55 34.42,55.68 32.39,55.68 31.5,54.79 31.5,52.18 v1(44.07,39.61)
TIM3_CH1: length 33.2
  Top Layer w0.254: v1(54.36,34.6) 49.65,34.6 U26.29 ; v1(58.42,31.68) 60.83,31.68 66.8,25.71 66.8,17.2 66.49,16.89 control
sampl.1
  Bottom Layer w0.254: v1(58.42,31.68) 55.5,34.6 v1(54.36,34.6)
TIM3_CH2: length 27.1
  Top Layer w0.254: v1(47.88,23.17) 47.88,23.87 44.95,26.8 U26.12 ; control
sampl.2 v1(47.88,18.14)
  Bottom Layer w0.254: v1(47.88,18.14) v1(47.88,23.17)
$1N5298: length 5.4
  Top Layer w0.254: BUZZER2.2 24.67,44.07 D24.1 24.54,46.24 Q10.3
$1N5299: length 2.6
  Top Layer w0.254: Q10.1 20.89,41.96 R116.2
$1N5859: length 10.4
  Top Layer w0.508: CN12.1 60.14,55.61 60.58,55.17 v1(60.58,53.78)
  Bottom Layer w0.508: v1(60.58,53.78) 55.37,53.78 54.99,54.16 54.99,55.78 55.01,55.8
$1N19115: length 2.7
  Top Layer w0.254: LED.2 9.41,54.74 R91.1
$1N23213: length 2.3
  Top Layer w0.254: U27.3 4.95,15.85 R19.2
$1N23214: length 2.5
  Top Layer w0.254: R18.2 0.98,14.3 U27.1
$1N23215: length 2.3
  Top Layer w0.254: R22.1 9.02,30.85 U27.18
$1N23223: length 2.3
  Top Layer w0.254: U27.16 12.95,30.84 R23.1

## Copper pours and planes (outline as drawn; the poured copper is in the pictures)
+3.3V on Top Layer: 16.38,43.74 16.2,43.67 16.13,43.49 16.13,42.19 16.11,42.1 16.05,42.01 15.84,41.8 15.79,41.72 15.77,41.62 15.77,37.25 15.84,37.07 16.02,37 18.14,37 18.32,37.07 18.39,37.25 18.39,43.49 18.32,43.67 18.14,43.74
GND on Top Layer: -8,74.99 74.55,74.99 74.55,-5.79 -8,-5.79
GND on Bottom Layer: -2.03,64.44 71.63,64.44 71.63,-5.02 -2.03,-5.02
GND on POWER: -5.72,70.8 70.74,70.8 70.74,-2.74 -5.72,-2.74
GND on GND: 0.26,59.74 69.74,59.74 69.74,0.26 0.26,0.26

Small or netless copper shapes (teardrops, artwork), in the pictures only: 1 on Top Layer

## Text on the board
Top Silkscreen Layer: GND | CLK | RX | SWD | TX | +5V | 3V3 | WAT2 | WAT1 | DLP2 | DLP1 | MOS | NTC | STP | DIR | EN | H | L | L_EN | R_EN | L_PH | R_PH | NRST | + | - | I | DEBUG | 5V / 输入
